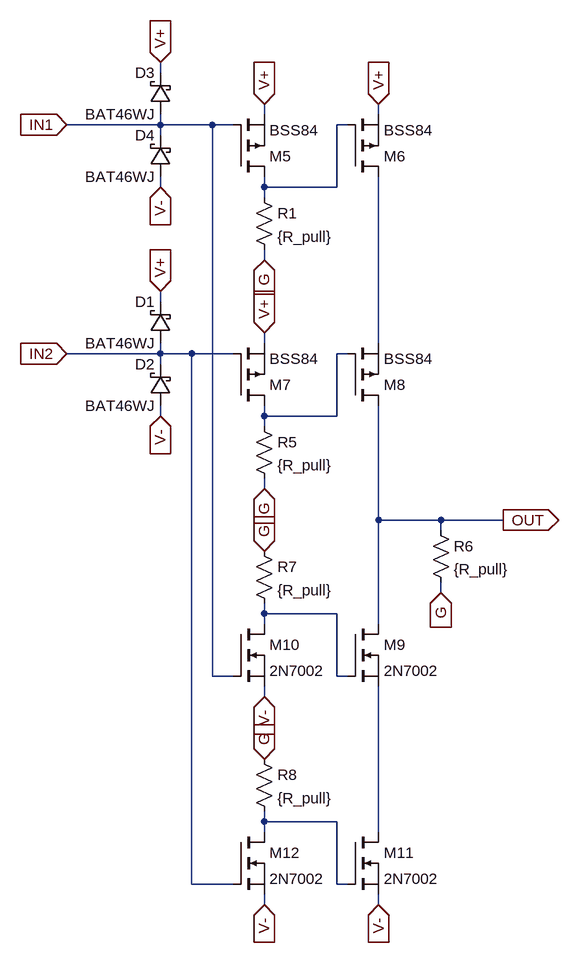
[diagram p0: schematic tri_sigadd.asc]
tri_sigadd.asc, the LTspice schematic file:
Version 4
SHEET 1 1196 1380
WIRE 528 -32 528 -48
WIRE 688 32 688 16
WIRE 864 32 864 16
WIRE 528 48 528 32
WIRE 528 48 384 48
WIRE 608 48 528 48
WIRE 640 48 608 48
WIRE 816 48 800 48
WIRE 528 64 528 48
WIRE 528 144 528 128
WIRE 688 144 688 128
WIRE 800 144 800 48
WIRE 800 144 688 144
WIRE 688 160 688 144
WIRE 688 256 688 240
WIRE 528 320 528 304
WIRE 688 384 688 368
WIRE 864 384 864 128
WIRE 528 400 528 384
WIRE 528 400 384 400
WIRE 576 400 528 400
WIRE 640 400 576 400
WIRE 816 400 800 400
WIRE 528 416 528 400
WIRE 528 496 528 480
WIRE 688 496 688 480
WIRE 800 496 800 400
WIRE 800 496 688 496
WIRE 688 512 688 496
WIRE 688 608 688 592
WIRE 864 656 864 480
WIRE 960 656 864 656
WIRE 1056 656 960 656
WIRE 960 672 960 656
WIRE 960 768 960 752
WIRE 688 800 688 784
WIRE 800 800 688 800
WIRE 688 816 688 800
WIRE 864 816 864 656
WIRE 608 896 608 48
WIRE 640 896 608 896
WIRE 800 896 800 800
WIRE 816 896 800 896
WIRE 688 928 688 912
WIRE 688 1120 688 1104
WIRE 800 1120 688 1120
WIRE 688 1136 688 1120
WIRE 864 1136 864 912
WIRE 576 1216 576 400
WIRE 640 1216 576 1216
WIRE 800 1216 800 1120
WIRE 816 1216 800 1216
WIRE 688 1248 688 1232
WIRE 864 1248 864 1232
FLAG 1056 656 OUT
IOPIN 1056 656 Out
FLAG 688 256 G
IOPIN 688 256 In
FLAG 688 16 V+
IOPIN 688 16 In
FLAG 864 16 V+
IOPIN 864 16 In
FLAG 688 608 G
IOPIN 688 608 In
FLAG 688 368 V+
IOPIN 688 368 In
FLAG 960 768 G
IOPIN 960 768 In
FLAG 688 928 V-
IOPIN 688 928 In
FLAG 688 704 G
IOPIN 688 704 In
FLAG 688 1248 V-
IOPIN 688 1248 In
FLAG 688 1024 G
IOPIN 688 1024 In
FLAG 864 1248 V-
IOPIN 864 1248 In
FLAG 528 144 V-
IOPIN 528 144 In
FLAG 384 48 IN1
IOPIN 384 48 In
FLAG 528 -48 V+
IOPIN 528 -48 In
FLAG 528 496 V-
IOPIN 528 496 In
FLAG 384 400 IN2
IOPIN 384 400 In
FLAG 528 304 V+
IOPIN 528 304 In
SYMBOL pmos 640 128 M180
SYMATTR InstName M5
SYMATTR Value BSS84
SYMBOL pmos 816 128 M180
SYMATTR InstName M6
SYMATTR Value BSS84
SYMBOL res 672 144 R0
SYMATTR InstName R1
SYMATTR Value {R_pull}
SYMBOL pmos 640 480 M180
SYMATTR InstName M7
SYMATTR Value BSS84
SYMBOL pmos 816 480 M180
SYMATTR InstName M8
SYMATTR Value BSS84
SYMBOL res 672 496 R0
SYMATTR InstName R5
SYMATTR Value {R_pull}
SYMBOL res 944 656 R0
SYMATTR InstName R6
SYMATTR Value {R_pull}
SYMBOL nmos 816 816 R0
SYMATTR InstName M9
SYMATTR Value 2N7002
SYMBOL nmos 640 816 R0
SYMATTR InstName M10
SYMATTR Value 2N7002
SYMBOL res 672 688 R0
SYMATTR InstName R7
SYMATTR Value {R_pull}
SYMBOL nmos 816 1136 R0
SYMATTR InstName M11
SYMATTR Value 2N7002
SYMBOL nmos 640 1136 R0
SYMATTR InstName M12
SYMATTR Value 2N7002
SYMBOL res 672 1008 R0
SYMATTR InstName R8
SYMATTR Value {R_pull}
SYMBOL schottky 544 32 R180
WINDOW 0 24 64 Left 2
WINDOW 3 24 0 Left 2
SYMATTR InstName D3
SYMATTR Value BAT46WJ
SYMATTR Description Diode
SYMATTR Type diode
SYMBOL schottky 544 128 R180
WINDOW 0 24 64 Left 2
WINDOW 3 24 0 Left 2
SYMATTR InstName D4
SYMATTR Value BAT46WJ
SYMATTR Description Diode
SYMATTR Type diode
SYMBOL schottky 544 384 R180
WINDOW 0 24 64 Left 2
WINDOW 3 24 0 Left 2
SYMATTR InstName D1
SYMATTR Value BAT46WJ
SYMATTR Description Diode
SYMATTR Type diode
SYMBOL schottky 544 480 R180
WINDOW 0 24 64 Left 2
WINDOW 3 24 0 Left 2
SYMATTR InstName D2
SYMATTR Value BAT46WJ
SYMATTR Description Diode
SYMATTR Type diode

The netlist it stands for:
* tri_sigadd.asc
M5 N001 IN1 V+ V+ BSS84
M6 N002 N001 V+ V+ BSS84
R1 N001 G {R_pull}
M7 N003 IN2 V+ V+ BSS84
M8 OUT N003 N002 N002 BSS84
R5 N003 G {R_pull}
R6 OUT G {R_pull}
M9 OUT N004 N006 N006 2N7002
M10 N004 IN1 V- V- 2N7002
R7 G N004 {R_pull}
M11 N006 N005 V- V- 2N7002
M12 N005 IN2 V- V- 2N7002
R8 G N005 {R_pull}
D3 IN1 V+ BAT46WJ
D4 V- IN1 BAT46WJ
D1 IN2 V+ BAT46WJ
D2 V- IN2 BAT46WJ
.model D D
.lib standard.dio
.model NMOS NMOS
.model PMOS PMOS
.lib standard.mos
.backanno
.end